# Altium schematic sheet display.SchDoc
size A4
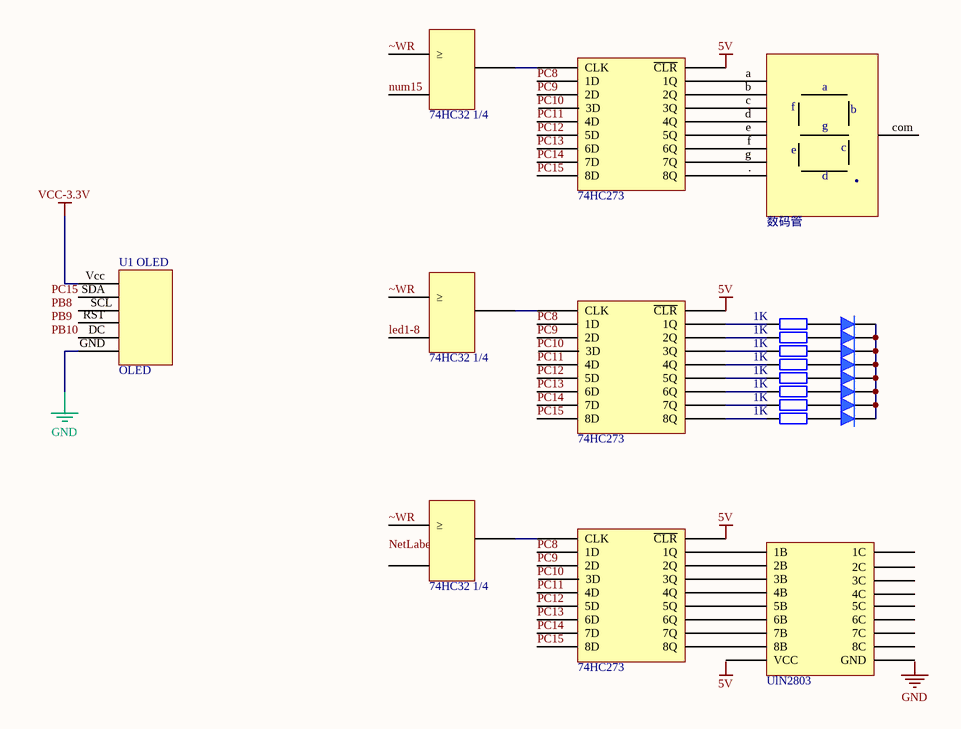
[diagram p0: display.SchDoc]

## Parts
1  LED  (value not drawn)
2  LED  (value not drawn)
3  LED  (value not drawn)
4  LED  (value not drawn)
5  LED  (value not drawn)
6  LED  (value not drawn)
7  LED  (value not drawn)
8  LED  (value not drawn)
11  value 1K  [AXIAL-0.4]  (hidden comment: Res2)
22  value 1K  [AXIAL-0.4]  (hidden comment: Res2)
33  value 1K  [AXIAL-0.4]  (hidden comment: Res2)
44  value 1K  [AXIAL-0.4]  (hidden comment: Res2)
55  value 1K  [AXIAL-0.4]  (hidden comment: Res2)
66  value 1K  [AXIAL-0.4]  (hidden comment: Res2)
77  value 1K  [AXIAL-0.4]  (hidden comment: Res2)
88  value 1K  [AXIAL-0.4]  (hidden comment: Res2)
*?  UlN2803
U1_OLED  OLED
U2  74HC32 1/4
U3  74HC32 1/4
U4  74HC32 1/4
U5  74HC273
U6  74HC273
U7  74HC273
U8  数码管

## Nets
5V: U5.0(~{CLR}) U6.0(~{CLR}) U7.0(~{CLR})
GND: U1_OLED.GND
VCC-3.3V: U1_OLED.Vcc
led1-8: U3.PRTCS
num15: U2.PRTCS
PC8: U5.10(1D) U6.10(1D) U7.10(1D)
PC9: U5.11(2D) U6.11(2D) U7.11(2D)
PC11: U5.13(4D) U6.13(4D) U7.13(4D)
PC12: U5.14(5D) U6.14(5D) U7.14(5D)
PC13: U5.15(6D) U6.15(6D) U7.15(6D)
PC14: U5.16(7D) U6.16(7D) U7.16(7D)
PC15: U5.17(8D) U6.17(8D) U7.17(8D)
~WR: U2.?1(≥) U3.?1(≥) U4.?1(≥)
Net1_g: 1.g 11.2
Net1_g: 1.g 2.g 3.g 4.g 5.g 6.g 7.g 8.g  [a separate net that carries the same name]
Net2_g: 2.g 22.2
Net3_g: 3.g 33.2
Net4_g: 4.g 44.2
Net5_g: 5.g 55.2
Net6_g: 6.g 66.2
Net7_g: 7.g 77.2
Net8_g: 8.g 88.2
Net11_1: 11.1 U6.1(1Q)
Net22_1: 22.1 U6.2(2Q)
Net33_1: 33.1 U6.3(3Q)
Net44_1: 44.1 U6.4(4Q)
Net55_1: 55.1 U6.5(5Q)
Net66_1: 66.1 U6.6(6Q)
Net77_1: 77.1 U6.7(7Q)
Net88_1: 88.1 U6.8(8Q)
Net*?_10: *?.10(1B) U7.1(1Q)
Net*?_11: *?.11(2B) U7.2(2Q)
Net*?_12: *?.12(3B) U7.3(3Q)
Net*?_13: *?.13(4B) U7.4(4Q)
Net*?_14: *?.14(5B) U7.5(5Q)
Net*?_15: *?.15(6B) U7.6(6Q)
Net*?_16: *?.16(7B) U7.7(7Q)
Net*?_17: *?.17(8B) U7.8(8Q)
NetU2_20: U2.20 U5.9(CLK)
NetU3_20: U3.20 U6.9(CLK)
NetU4_20: U4.20 U7.9(CLK)
NetU5_1: U5.1(1Q) U8.a
NetU5_2: U5.2(2Q) U8.b(a)
NetU5_3: U5.3(3Q) U8.c(a)
NetU5_4: U5.4(4Q) U8.d(a)
NetU5_5: U5.5(5Q) U8.e(a)
NetU5_6: U5.6(6Q) U8.f(a)
NetU5_7: U5.7(7Q) U8.g(a)
NetU5_8: U5.8(8Q) U8..(a)

Not connected (* = marked no-connect by the designer): *? 0(1C) 1(2C) 2(3C) 3(4C) 4(5C) 5(6C) 6(7C) 7(8C) 8(GND) 9(VCC); U1_OLED DC(5) RST(4) SCL(3) SDA(2); U4 PRTCS(19); U5 12(3D); U6 12(3D); U7 12(3D); U8 com(a)

## Notes on the sheet
- Labels drawn without touching a wire or pin: 5V, GND, NetLabel22, PB8, PB9, PB10, PC10, PC15

## Library data of the parts
11 22 33 44 55 66 77 88 = Res2: Resistor; Published: 8-Jun-2000; LatestRevisionDate: 17-Jul-2002; LatestRevisionNote: Re-released for DXP Platform.; PackageReference: AXIAL-0.4; Publisher: Altium Limited; PackageDescription: Axial Device, Thru-Hole; 2 Leads; 0.4 in Pin Spacing